# EAGLE schematic Tribble (EAGLE 6.2)
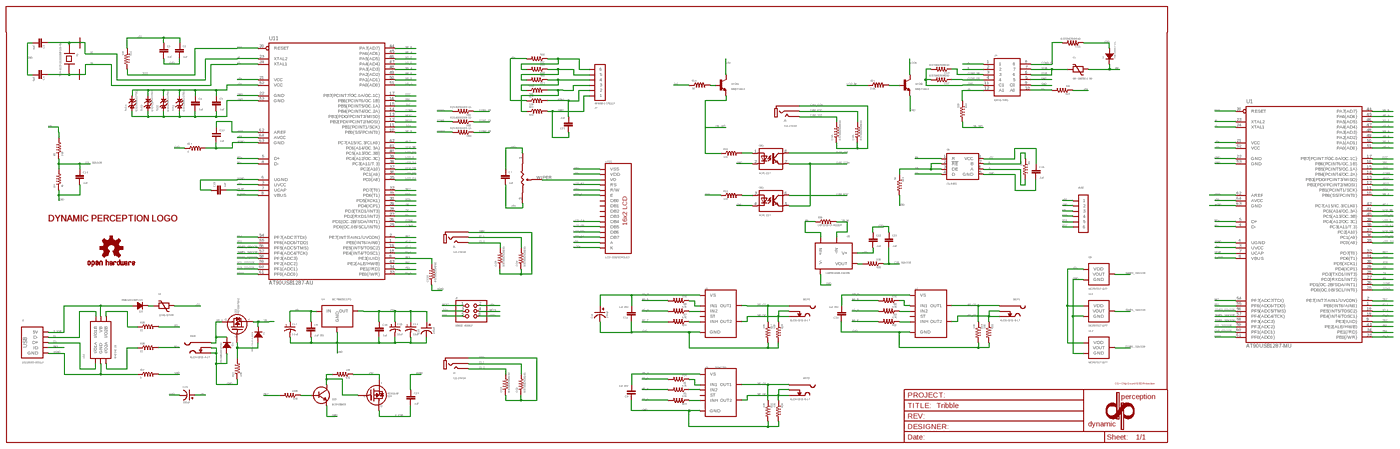
[diagram p0: schematic, sheet 1, overview]
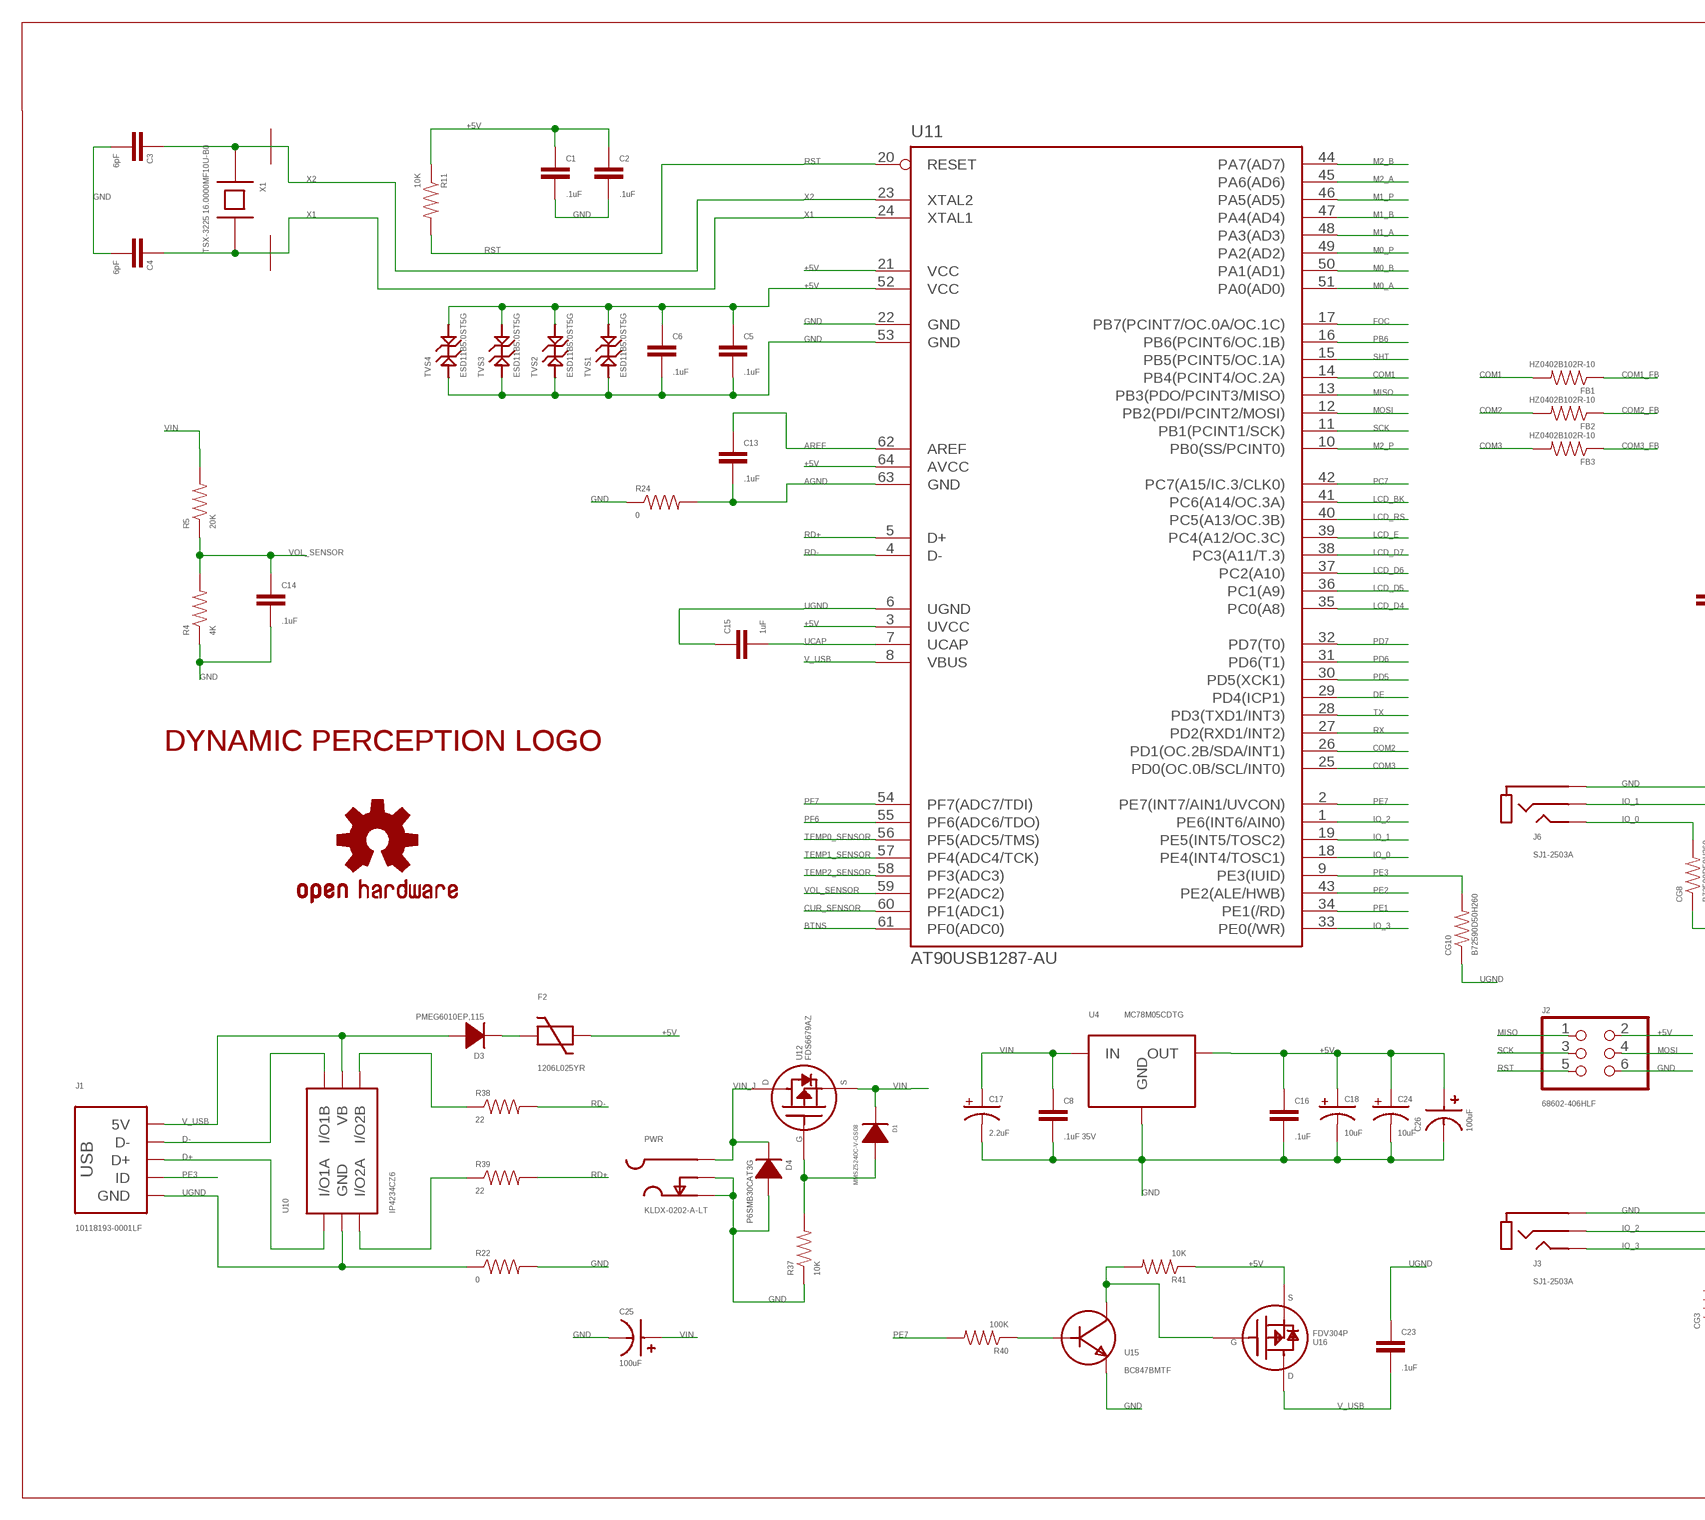
[diagram p1: schematic, sheet 1, part 1 of 4]
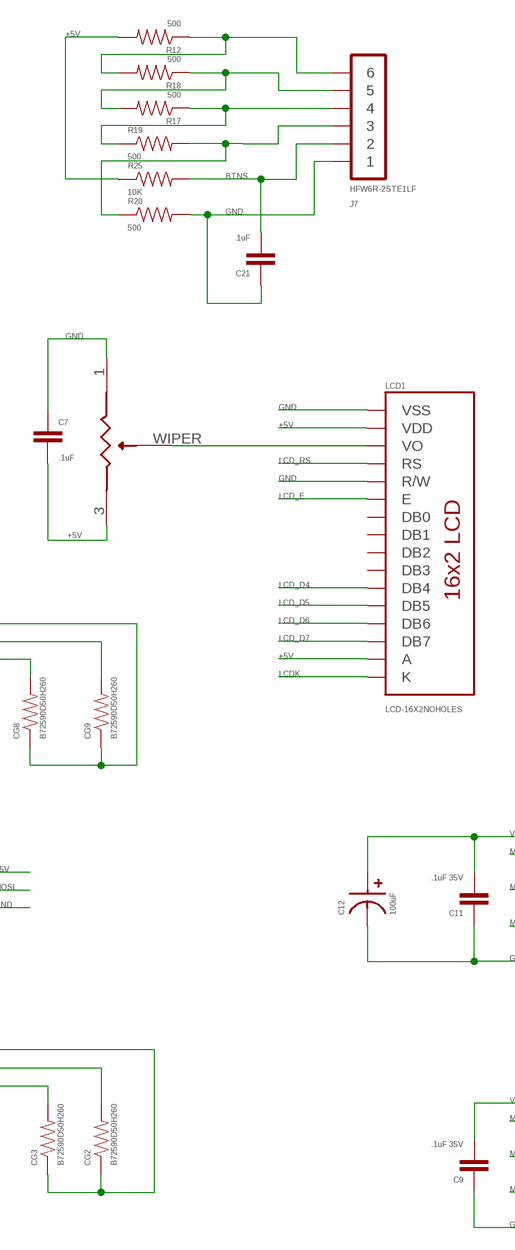
[diagram p2: schematic, sheet 1, part 2 of 4]
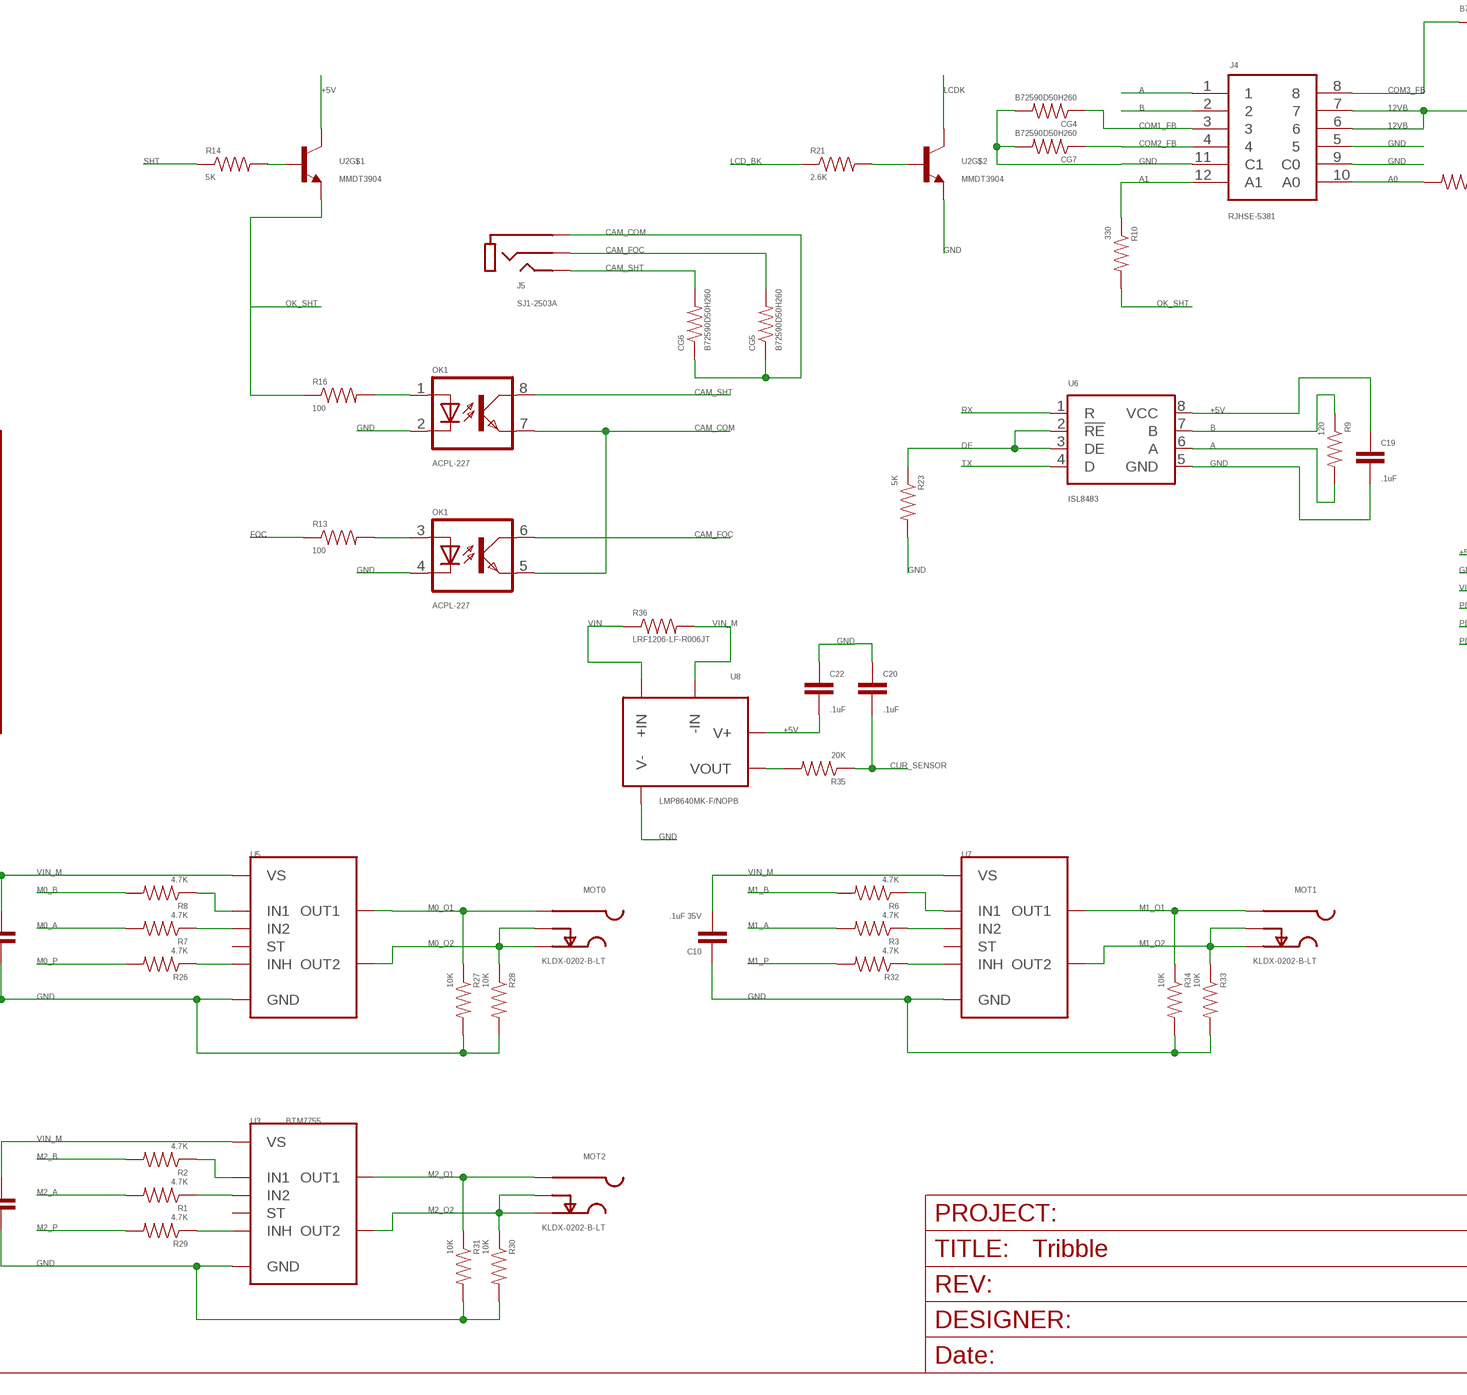
[diagram p3: schematic, sheet 1, part 3 of 4]
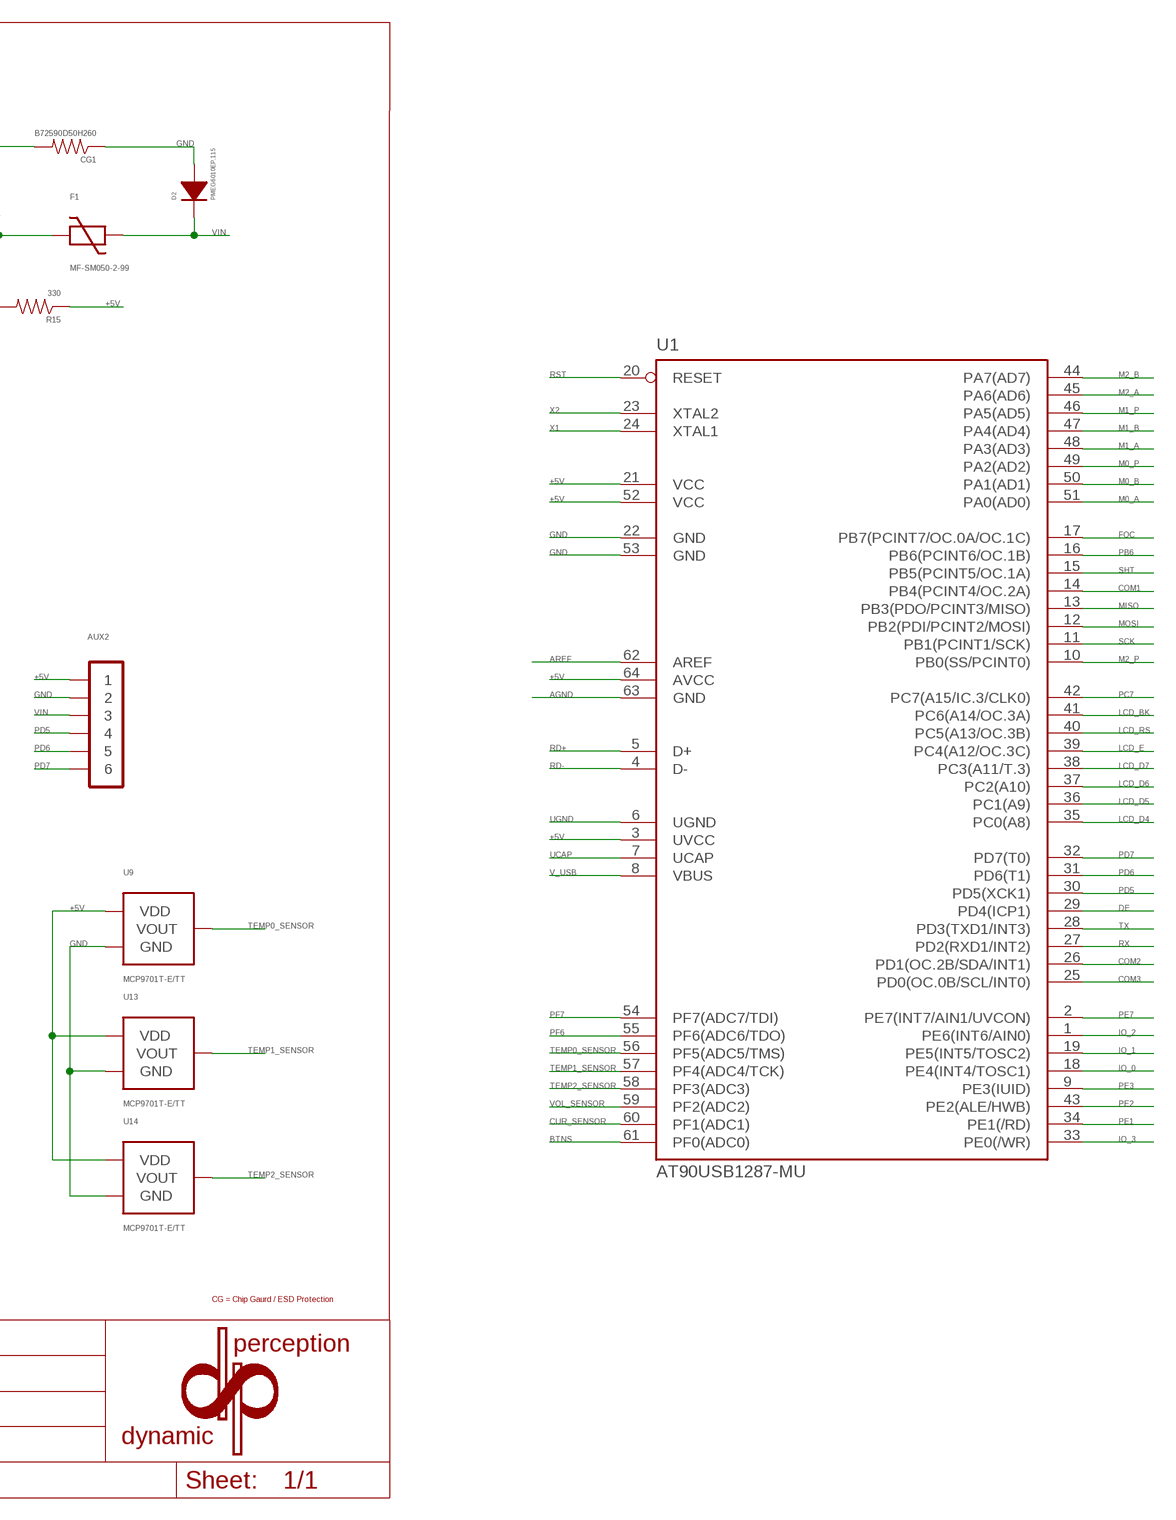
[diagram p4: schematic, sheet 1, part 4 of 4]

## Parts
AUX2  PH_1X06SMALL_PTH  [HEADER_01X06_SMALL_PTH]
C1  .1uF  CAP_NONPOL0402  [0402_CAP]
C2  .1uF  CAP_NONPOL0402  [0402_CAP]
C3  6pF  CAP0402  [C0402]
C4  6pF  CAP0402  [C0402]
C5  .1uF  CAP_NONPOL0402  [0402_CAP]
C6  .1uF  CAP_NONPOL0402  [0402_CAP]
C7  .1uF  CAP_NONPOL0402  [0402_CAP]
C8  .1uF 35V  CAP_NONPOL0402  [0402_CAP]
C9  .1uF 35V  CAP_NONPOL0402  [0402_CAP]
C10  .1uF 35V  CAP_NONPOL0402  [0402_CAP]
C11  .1uF 35V  CAP_NONPOL0402  [0402_CAP]
C12  100uF  CAPACITOR_POLARIZED6.3MM_SMD  [6.3MM_CAP_SMD]
C13  .1uF  CAP_NONPOL0402  [0402_CAP]
C14  .1uF  CAP_NONPOL0402  [0402_CAP]
C15  1uF  CAP_NONPOL0402  [0402_CAP]
C16  .1uF  CAP_NONPOL0402  [0402_CAP]
C17  2.2uF  CAP_POL1206  [EIA3216]
C18  10uF  CAP_POL1206  [EIA3216]
C19  .1uF  CAP_NONPOL0402  [0402_CAP]
C20  .1uF  CAP_NONPOL0402  [0402_CAP]
C21  .1uF  CAP_NONPOL0402  [0402_CAP]
C22  .1uF  CAP_NONPOL0402  [0402_CAP]
C23  .1uF  CAP_NONPOL0402  [0402_CAP]
C24  10uF  CAP_POL1206  [EIA3216]
C25  100uF  CAPACITOR_POLARIZED6.3MM_SMD  [6.3MM_CAP_SMD]
C26  100uF  CAPACITOR_POLARIZED5MM_SMD  [5MM_CAP_SMD]
CG1  B72590D50H260  RESISTOR0402  [0402_RES]
CG2  B72590D50H260  RESISTOR0402  [0402_RES]
CG3  B72590D50H260  RESISTOR0402  [0402_RES]
CG4  B72590D50H260  RESISTOR0402  [0402_RES]
CG5  B72590D50H260  RESISTOR0402  [0402_RES]
CG6  B72590D50H260  RESISTOR0402  [0402_RES]
CG7  B72590D50H260  RESISTOR0402  [0402_RES]
CG8  B72590D50H260  RESISTOR0402  [0402_RES]
CG9  B72590D50H260  RESISTOR0402  [0402_RES]
CG10  B72590D50H260  RESISTOR0402  [0402_RES]
D1  MMSZ5240C-V-GS08  DIODESOD-123  [SOD-123]
D2  PMEG6010EP,115  DIODESOD-128  [SOD-128]
D3  PMEG6010EP,115  DIODESOD-128  [SOD-128]
D4  P6SMB30CAT3G  DIODEDO-214AA  [DO-214AA]
F1  MF-SM050-2-99  PTC_FUSE2920  [2920]
F2  1206L025YR  PTC_FUSE1206  [1206]
FB1  HZ0402B102R-10  RESISTOR0402  [0402_RES]
FB2  HZ0402B102R-10  RESISTOR0402  [0402_RES]
FB3  HZ0402B102R-10  RESISTOR0402  [0402_RES]
J1  10118193-0001LF  USB10118193-0001LF  [10118193-0001LF]
J2  68602-406HLF  P2X03  [P2X03]
J3  SJ1-2503A  TRS_STEREO_JACKSJ1-2503A  [SJ1-2503A]
J4  RJHSE-5381  RJHS-538X  [RIGHT_ANGLE]
J5  SJ1-2503A  TRS_STEREO_JACKSJ1-2503A  [SJ1-2503A]
J6  SJ1-2503A  TRS_STEREO_JACKSJ1-2503A  [SJ1-2503A]
J7  HFW6R-2STE1LF  PH_1X06FFC  [HFW6R-2STE1LF]
LCD1  LCD-16X2NOHOLES  [LCD-16X2_NOHOLES]
LOGO1  DP_LOGOSMALL  [DP_LOGO_SMALL]
LOGO2  DP_LOGOMICRO  [DP_LOGO_MICRO]
MOT0  KLDX-0202-B-LT  DC_JACKPTH_TIGHT  [DC_JACK_PTH_TIGHT]
MOT1  KLDX-0202-B-LT  DC_JACKPTH_TIGHT  [DC_JACK_PTH_TIGHT]
MOT2  KLDX-0202-B-LT  DC_JACKPTH_TIGHT  [DC_JACK_PTH_TIGHT]
OK1  ACPL-227  [SOIC8]
P1  TC33X-2  [3MMSMD]
PWR  KLDX-0202-A-LT  DC_JACKPTH_TIGHT  [DC_JACK_PTH_TIGHT]
R1  4.7K  RESISTOR0402  [0402_RES]
R2  4.7K  RESISTOR0402  [0402_RES]
R3  4.7K  RESISTOR0402  [0402_RES]
R4  4K  RESISTOR0402  [0402_RES]
R5  20K  RESISTOR0402  [0402_RES]
R6  4.7K  RESISTOR0402  [0402_RES]
R7  4.7K  RESISTOR0402  [0402_RES]
R8  4.7K  RESISTOR0402  [0402_RES]
R9  120  RESISTOR0402  [0402_RES]
R10  330  RESISTOR0402  [0402_RES]
R11  10K  RESISTOR0402  [0402_RES]
R12  500  RESISTOR0402  [0402_RES]
R13  100  RESISTOR0402  [0402_RES]
R14  5K  RESISTOR0402  [0402_RES]
R15  330  RESISTOR0402  [0402_RES]
R16  100  RESISTOR0402  [0402_RES]
R17  500  RESISTOR0402  [0402_RES]
R18  500  RESISTOR0402  [0402_RES]
R19  500  RESISTOR0402  [0402_RES]
R20  500  RESISTOR0402  [0402_RES]
R21  2.6K  RESISTOR0402  [0402_RES]
R22  0  RESISTOR0402  [0402_RES]
R23  5K  RESISTOR0402  [0402_RES]
R24  0  RESISTOR0402  [0402_RES]
R25  10K  RESISTOR0402  [0402_RES]
R26  4.7K  RESISTOR0402  [0402_RES]
R27  10K  RESISTOR0805  [0805]
R28  10K  RESISTOR0805  [0805]
R29  4.7K  RESISTOR0402  [0402_RES]
R30  10K  RESISTOR0805  [0805]
R31  10K  RESISTOR0805  [0805]
R32  4.7K  RESISTOR0402  [0402_RES]
R33  10K  RESISTOR0805  [0805]
R34  10K  RESISTOR0805  [0805]
R35  20K  RESISTOR0402  [0402_RES]
R36  LRF1206-LF-R006JT  RESISTOR1206  [1206]
R37  10K  RESISTOR0402  [0402_RES]
R38  22  RESISTOR0402  [0402_RES]
R39  22  RESISTOR0402  [0402_RES]
R40  100K  RESISTOR0402  [0402_RES]
R41  10K  RESISTOR0402  [0402_RES]
TVS1  ESD11B5.0ST5G  TVS_DIODEDSN-2  [DSN-2]
TVS2  ESD11B5.0ST5G  TVS_DIODEDSN-2  [DSN-2]
TVS3  ESD11B5.0ST5G  TVS_DIODEDSN-2  [DSN-2]
TVS4  ESD11B5.0ST5G  TVS_DIODEDSN-2  [DSN-2]
U1  AT90USB1287-MU  AT90USB647-MU  [MLF64]
U2  MMDT3904  [SOT363]
U3  BTM7755  BTM7755PG-DSO-36-29  [PG-DSO-36-29]
U4  MC78M05CDTG  FIXED_VOLTAGE_REGDPAK-3  [DPAK-3]
U5  BTM7755PG-DSO-36-29  [PG-DSO-36-29]
U6  ISL8483  SN65176D  [SO-08]
U7  BTM7755PG-DSO-36-29  [PG-DSO-36-29]
U8  LMP8640MK-F/NOPB  LMP8640TSOT-6  [TSOT-6]
U9  MCP9701T-E/TT  MCP970XSOT-23-3  [SOT-23-3]
U10  IP4234CZ6  IP4234CZ6SOT-457  [SOT-457]
U11  AT90USB1287-AU  AT90USB647-AU  [TQFP64]
U12  FDS6679AZ  MOSFET_P-CHANNEL_SINGLEP3-POWER  [DSO-8]
U13  MCP9701T-E/TT  MCP970XSOT-23-3  [SOT-23-3]
U14  MCP9701T-E/TT  MCP970XSOT-23-3  [SOT-23-3]
U15  BC847BMTF  BJT_NPN_SINGLESOT-23  [SOT-23]
U16  FDV304P  MOSFET_P-CHANNEL_SINGLESOT-23  [SOT-23]
U$1  DP_FRAME  [DP_FRAME]
U$2  OSHW-LOGOS  [OSHW-LOGO-S]
X1  TSX-3225 16.0000MF10U-B0  3.2X2.5MMCRYSTAL  [3.2X2.5MM]

## Nets
12VB: F1.1 J4.6 J4.7
+5V [usbvcc]: AUX2.1 C1.1 C2.1 C5.1 C6.1 C7.2 C16.1 C18.A(+) C19.1 C22.2 C24.A(+) C26.P(POS) F2.2 J2.2 LCD1.2(VDD) LCD1.15(A) P1.3 R11.1 R12.2 R15.1 R25.1 R41.1 TVS1.P$2 TVS2.P$2 TVS3.P$2 TVS4.P$2 U1.3(UVCC) U1.21(VCC) U1.52(VCC) U1.64(AVCC) U2.3(C) U4.2(OUT) U6.8(VCC) U8.6(V+) U9.1(VDD) U11.3(UVCC) U11.21(VCC) U11.52(VCC) U11.64(AVCC) U13.1(VDD) U14.1(VDD) U16.2(SOURCE)
A: J4.1 R9.2 U6.6(A)
A0: J4.10(A0) R15.2
A1: J4.12(A1) R10.1
AGND: C13.2 R24.2 U1.63(GND) U11.63(GND)
AREF [aref]: C13.1 U1.62(AREF) U11.62(AREF)
B: J4.2 R9.1 U6.7(B)
BTNS: C21.2 J7.2 R25.2 U1.61(PF0(ADC0)) U11.61(PF0(ADC0))
CAM_COM: CG5.1 CG6.1 J5.1(S) OK1.5(EMIT1) OK1.7(EMIT)
CAM_FOC: CG5.2 J5.4(R) OK1.6(COL1)
CAM_SHT: CG6.2 J5.2(T) J5.3(T) OK1.8(COL)
COM1: FB1.2 U1.14(PB4(PCINT4/OC.2A)) U11.14(PB4(PCINT4/OC.2A))
COM1_FB: CG4.1 FB1.1 J4.3
COM2: FB2.2 U1.26(PD1(OC.2B/SDA/INT1)) U11.26(PD1(OC.2B/SDA/INT1))
COM2_FB: CG7.1 FB2.1 J4.4
COM3: FB3.2 U1.25(PD0(OC.0B/SCL/INT0)) U11.25(PD0(OC.0B/SCL/INT0))
COM3_FB: CG1.2 FB3.1 J4.8
CUR_SENSOR: C20.2 R35.1 U1.60(PF1(ADC1)) U11.60(PF1(ADC1))
D+: J1.3(D+) U10.1(I/O1A)
D-: J1.2(D-) U10.6(I/O1B)
DE: R23.1 U1.29(PD4(ICP1)) U6.2(!RE) U6.3(DE) U11.29(PD4(ICP1))
FDV_GATE: R41.2 U15.3(COLLECTOR) U16.1(GATE)
FOC: R13.1 U1.17(PB7(PCINT7/OC.0A/OC.1C)) U11.17(PB7(PCINT7/OC.0A/OC.1C))
GND: AUX2.2 C1.2 C2.2 C3.1 C4.1 C5.2 C6.2 C7.1 C8.2 C9.1 C10.1 C11.1 C12.NEG C14.2 C16.2 C17.C(-) C18.C(-) C19.2 C20.1 C21.1 C22.1 C24.C(-) C25.NEG C26.N(NEG) CG1.1 CG2.1 CG3.1 CG4.2 CG7.2 CG8.1 CG9.1 D2.ANODE D4.A(ANODE) J2.6 J3.1(S) J4.5 J4.9(C0) J4.11(C1) J6.1(S) J7.1 LCD1.1(VSS) LCD1.5(R/W) OK1.2(C) OK1.4(C1) P1.1 PWR.GND(SLEEVE) PWR.GNDBREAK(SLEEVE_SHUNT) R4.1 R20.2 R22.2 R23.2 R24.1 R27.2 R28.2 R30.2 R31.2 R33.2 R34.2 R37.1 TVS1.P$1 TVS2.P$1 TVS3.P$1 TVS4.P$1 U1.22(GND) U1.53(GND) U2.1(E) U3.5(GND) U3.6(GND) U3.7(GND) U3.8(GND) U3.23(GND) U3.24(GND) U3.25(GND) U3.26(GND) U4.4(GND) U5.5(GND) U5.6(GND) U5.7(GND) U5.8(GND) U5.23(GND) U5.24(GND) U5.25(GND) U5.26(GND) U6.5(GND) U7.5(GND) U7.6(GND) U7.7(GND) U7.8(GND) U7.23(GND) U7.24(GND) U7.25(GND) U7.26(GND) U8.2(V-) U9.3(GND) U11.22(GND) U11.53(GND) U13.3(GND) U14.3(GND) U15.2(EMITTER)
IO_0: CG8.2 J6.2(T) J6.3(T) U1.18(PE4(INT4/TOSC1)) U11.18(PE4(INT4/TOSC1))
IO_1: CG9.2 J6.4(R) U1.19(PE5(INT5/TOSC2)) U11.19(PE5(INT5/TOSC2))
IO_2: CG2.2 J3.4(R) U1.1(PE6(INT6/AIN0)) U11.1(PE6(INT6/AIN0))
IO_3: CG3.2 J3.2(T) J3.3(T) U1.33(PE0(/WR)) U11.33(PE0(/WR))
LCD_BK: R21.1 U1.41(PC6(A14/OC.3A)) U11.41(PC6(A14/OC.3A))
LCD_D4: LCD1.11(DB4) U1.35(PC0(A8)) U11.35(PC0(A8))
LCD_D5: LCD1.12(DB5) U1.36(PC1(A9)) U11.36(PC1(A9))
LCD_D6: LCD1.13(DB6) U1.37(PC2(A10)) U11.37(PC2(A10))
LCD_D7: LCD1.14(DB7) U1.38(PC3(A11/T.3)) U11.38(PC3(A11/T.3))
LCD_E: LCD1.6(E) U1.39(PC4(A12/OC.3C)) U11.39(PC4(A12/OC.3C))
LCD_RS: LCD1.4(RS) U1.40(PC5(A13/OC.3B)) U11.40(PC5(A13/OC.3B))
LCDK: LCD1.16(K) U2.6(C)
M0_A: R7.2 U1.51(PA0(AD0)) U11.51(PA0(AD0))
M0_A1: R7.1 U5.10(IN2)
M0_B: R8.2 U1.50(PA1(AD1)) U11.50(PA1(AD1))
M0_B1: R8.1 U5.9(IN1)
M0_O1: MOT0.PWR(PIN) R27.1 U5.1(OUT1) U5.2(OUT1) U5.3(OUT1) U5.4(OUT1) U5.33(OUT1) U5.34(OUT1) U5.35(OUT1) U5.36(OUT1)
M0_O2: MOT0.GND(SLEEVE) MOT0.GNDBREAK(SLEEVE_SHUNT) R28.1 U5.15(OUT2) U5.16(OUT2) U5.17(OUT2) U5.18(OUT2) U5.19(OUT2) U5.20(OUT2) U5.21(OUT2) U5.22(OUT2)
M0_P: R26.2 U1.49(PA2(AD2)) U11.49(PA2(AD2))
M0_P1: R26.1 U5.27(INH)
M1_A: R3.2 U1.48(PA3(AD3)) U11.48(PA3(AD3))
M1_B: R6.2 U1.47(PA4(AD4)) U11.47(PA4(AD4))
M1_O1: MOT1.PWR(PIN) R34.1 U7.1(OUT1) U7.2(OUT1) U7.3(OUT1) U7.4(OUT1) U7.33(OUT1) U7.34(OUT1) U7.35(OUT1) U7.36(OUT1)
M1_O2: MOT1.GND(SLEEVE) MOT1.GNDBREAK(SLEEVE_SHUNT) R33.1 U7.15(OUT2) U7.16(OUT2) U7.17(OUT2) U7.18(OUT2) U7.19(OUT2) U7.20(OUT2) U7.21(OUT2) U7.22(OUT2)
M1_P: R32.2 U1.46(PA5(AD5)) U11.46(PA5(AD5))
M2_A: R1.2 U1.45(PA6(AD6)) U11.45(PA6(AD6))
M2_B: R2.2 U1.44(PA7(AD7)) U11.44(PA7(AD7))
M2_O1: MOT2.PWR(PIN) R31.1 U3.1(OUT1) U3.2(OUT1) U3.3(OUT1) U3.4(OUT1) U3.33(OUT1) U3.34(OUT1) U3.35(OUT1) U3.36(OUT1)
M2_O2: MOT2.GND(SLEEVE) MOT2.GNDBREAK(SLEEVE_SHUNT) R30.1 U3.15(OUT2) U3.16(OUT2) U3.17(OUT2) U3.18(OUT2) U3.19(OUT2) U3.20(OUT2) U3.21(OUT2) U3.22(OUT2)
M2_P: R29.2 U1.10(PB0(SS/PCINT0)) U11.10(PB0(SS/PCINT0))
MISO: J2.1 U1.13(PB3(PDO/PCINT3/MISO)) U11.13(PB3(PDO/PCINT3/MISO))
MOSI: J2.4 U1.12(PB2(PDI/PCINT2/MOSI)) U11.12(PB2(PDI/PCINT2/MOSI))
N$1: R35.2 U8.1(VOUT)
N$3: D1.ANODE R37.2 U12.4(GATE)
N$4: R3.1 U7.10(IN2)
N$5: R21.2 U2.2(B)
N$6: R6.1 U7.9(IN1)
N$7: R32.1 U7.27(INH)
N$8: R29.1 U3.27(INH)
N$9: R2.1 U3.9(IN1)
N$10: R1.1 U3.10(IN2)
N$11: R38.1 U10.4(I/O2B)
N$13: R39.1 U10.3(I/O2A)
N$14: D3.CATHODE F2.1
N$21: LCD1.3(VO) P1.WIPER
N$22: OK1.3(A1) R13.2
N$23: OK1.1(A) R16.2
N$25: R14.2 U2.5(B)
N$27: J7.6 R12.1 R18.2
N$28: J7.4 R17.1 R19.1
N$29: J7.5 R17.2 R18.1
N$30: J7.3 R19.2 R20.1
OK_SHT: R10.2 R16.1 U2.4(E)
PB6: U1.16(PB6(PCINT6/OC.1B)) U11.16(PB6(PCINT6/OC.1B))
PC7: U1.42(PC7(A15/IC.3/CLK0)) U11.42(PC7(A15/IC.3/CLK0))
PD5: AUX2.4 U1.30(PD5(XCK1)) U11.30(PD5(XCK1))
PD6: AUX2.5 U1.31(PD6(T1)) U11.31(PD6(T1))
PD7: AUX2.6 U1.32(PD7(T0)) U11.32(PD7(T0))
PE1: U1.34(PE1(/RD)) U11.34(PE1(/RD))
PE2: U1.43(PE2(ALE/HWB)) U11.43(PE2(ALE/HWB))
PE3: CG10.2 J1.4(ID) U1.9(PE3(IUID)) U11.9(PE3(IUID))
PE7: R40.2 U1.2(PE7(INT7/AIN1/UVCON)) U11.2(PE7(INT7/AIN1/UVCON))
PE7_GATE: R40.1 U15.1(BASE)
PF6: U1.55(PF6(ADC6/TDO)) U11.55(PF6(ADC6/TDO))
PF7: U1.54(PF7(ADC7/TDI)) U11.54(PF7(ADC7/TDI))
RD+: R39.2 U1.5(D+) U11.5(D+)
RD-: R38.2 U1.4(D-) U11.4(D-)
RST: J2.5 R11.2 U1.20(RESET) U11.20(RESET)
RX: U1.27(PD2(RXD1/INT2)) U6.1(R) U11.27(PD2(RXD1/INT2))
SCK: J2.3 U1.11(PB1(PCINT1/SCK)) U11.11(PB1(PCINT1/SCK))
SHT: R14.1 U1.15(PB5(PCINT5/OC.1A)) U11.15(PB5(PCINT5/OC.1A))
TEMP0_SENSOR: U1.56(PF5(ADC5/TMS)) U9.2(VOUT) U11.56(PF5(ADC5/TMS))
TEMP1_SENSOR: U1.57(PF4(ADC4/TCK)) U11.57(PF4(ADC4/TCK)) U13.2(VOUT)
TEMP2_SENSOR: U1.58(PF3(ADC3)) U11.58(PF3(ADC3)) U14.2(VOUT)
TX: U1.28(PD3(TXD1/INT3)) U6.4(D) U11.28(PD3(TXD1/INT3))
UCAP: C15.2 U1.7(UCAP) U11.7(UCAP)
UGND: C15.1 C23.1 CG10.1 J1.5(GND) J1.S1(GND) J1.S2(GND) J1.S3(GND) J1.S4(GND) R22.1 U1.6(UGND) U10.2(GND) U11.6(UGND)
V_USB: C23.2 D3.ANODE J1.1(5V) U1.8(VBUS) U10.5(VB) U11.8(VBUS) U16.3(DRAIN)
VIN [power]: AUX2.3 C8.1 C17.A(+) C25.POS D1.CATHODE D2.CATHODE F1.2 R5.2 R36.1 U4.1(IN) U8.3(+IN) U12.1(SOURCE) U12.2(SOURCE) U12.3(SOURCE)
VIN_J: D4.C(CATHODE) PWR.PWR(PIN) U12.5(DRAIN) U12.6(DRAIN) U12.7(DRAIN) U12.8(DRAIN)
VIN_M [power]: C9.2 C10.2 C11.2 C12.POS R36.2 U3.11(VS) U3.12(VS) U3.13(VS) U3.14(VS) U3.29(VS) U3.30(VS) U3.31(VS) U3.32(VS) U5.11(VS) U5.12(VS) U5.13(VS) U5.14(VS) U5.29(VS) U5.30(VS) U5.31(VS) U5.32(VS) U7.11(VS) U7.12(VS) U7.13(VS) U7.14(VS) U7.29(VS) U7.30(VS) U7.31(VS) U7.32(VS) U8.4(-IN)
VOL_SENSOR: C14.1 R4.2 R5.1 U1.59(PF2(ADC2)) U11.59(PF2(ADC2))
X1: C4.2 U1.24(XTAL1) U11.24(XTAL1) X1.3
X2: C3.2 U1.23(XTAL2) U11.23(XTAL2) X1.1
Unconnected: LCD1.7(DB0) LCD1.8(DB1) LCD1.9(DB2) LCD1.10(DB3) U3.28(ST) U5.28(ST) U7.28(ST)

## Notes on the sheet
- CG = Chip Gaurd / ESD Protection

## Power pins joined to a net without a drawn wire
4: X1.4
GND: X1.2(GND)

## Library data of the parts
AUX2 J7 = PP_Connectors:PH_1X06: 6 pin connectors
C1 C2 C5-C11 C13-C16 C19-C23 = parkers_parts:CAP_NONPOL
C3 C4 = SparkFun:CAP: Capacitor Standard 0603 ceramic capacitor, and 0.1" leaded capacitor.
C12 C25 C26 = PP_Passives:CAPACITOR_POLARIZED: Polarized capacitors
C17 C18 C24 = SparkFun:CAP_POL: Capacitor Polarized These are standard SMD and PTH capacitors. Normally 10uF, 47uF, and 100uF in electrolytic and tantalum varieties. Always verify the external diameter of the through hole cap, it varies with capacity, voltage, and manufacturer. The EIA devices should be standard.
CG1-CG10 FB1-FB3 R1-R26 R29 R32 R35 R37-R41 = parkers_parts:RESISTOR
D1 D2 = parkers_parts:DIODE
D3 D4 = PP_Passives:DIODE: Diode - Single
F1 F2 = PP_Passives:PTC_FUSE
J1 = PP_Connectors:USB
J2 = parkers_parts:P2X03
J3 J5 J6 = parkers_parts:TRS_STEREO_JACK
J4 = amphenol ethernet:RJHS-538X: RJHS-538X series right-angle ethernet (RJ45) connector with two LEDs
LCD1 = SparkFun-Displays:LCD-16X2: Standard text-only 16x2 parallel input LCD
LOGO1 LOGO2 = parkers_parts:DP_LOGO
MOT0 MOT1 MOT2 PWR = PP_Connectors:DC_JACK: DC JACK
OK1 = avago-opto:ACPL-227: ACPL-227 Dual optocoupler SOIC8
P1 = bourns trimpot:TC33X-2: Bourns TC33X-2 SMD Trimmer Potentiometer
R27 R28 R30 R31 R33 R34 R36 = PP_Passives:RESISTOR: Resistors
TVS1-TVS4 = PP_Passives:TVS_DIODE
U1 U11 = at90usb:AT90USB647-*: Atmel AT90USB647 AVR Microcontroller with USB Interface and 64kB Flash Memory
U2 = SparkFun-DiscreteSemi:MMDT3904: Dual NPN transistor
U3 U5 U7 = PP_PowerIC:BTM7755: Manufacturer Part #: BTM7755 Manufacturer: Infineon Technologies Description: Motor / Motion / Ignition Controllers & Drivers Hi Current H-Bridge Trilith IC 3G
U4 = PP_PowerIC:FIXED_VOLTAGE_REG
U6 = texas:SN65176: DIFFERENTIAL BUS TRANSCEIVER Source: http://focus.ti.com .. sn65176b.pdf; MF: TEXAS INSTRUMENTS; MPN: SN65176BD; OC_FARNELL: 9589970; OC_NEWARK: 08F5891
U8 = PP_AnalogIC:LMP8640
U9 U13 U14 = PP_Sensors:MCP970X
U10 = PP_Passives:IP4234CZ6: Mouser Part #: 771-IP4234CZ6125 Manufacturer Part #: IP4234CZ6,125 Manufacturer: NXP Semiconductors Description: ESD Suppressors Single USB 2.0 ESD Protection 6-Pin http://www.mouser.com/ProductDetail/NXP-Semiconductors/IP4234CZ6125/?qs=sGAEpiMZZMvxHShE6Whpu7QUdHOfUl1T0xbl582qhFk%3d
U12 U16 = PP_DiscreteSemi:MOSFET_P-CHANNEL_SINGLE
U15 = PP_DiscreteSemi:BJT_NPN_SINGLE: BJT NPN - Single
U$1 = parkers_parts:DP_FRAME; DNAME: Parker Dillmann; PNAME: MX-3; REVNUM: 8
U$2 = SparkFun-Aesthetics:OSHW-LOGO: Open Source Hardware Logo This logo indicates the piece of hardware it is found on incorporates a OSHW license and/or adheres to the definition of open source hardware found here: http://freedomdefined.org/OSHW
X1 = kyocera-crystals:3.2X2.5MMCRYSTAL: Kyocera 3.2x2.5 Mobile Crystal

## Net classes
1 power: clearance 0.254 mm
2 gnd: clearance 0.254 mm
3 usbvcc: clearance 0.254 mm
4 aref: clearance 0.254 mm